# EAGLE schematic matrix (EAGLE 5.10)

## Sheet 1 of 2

## Sheet 2 of 2
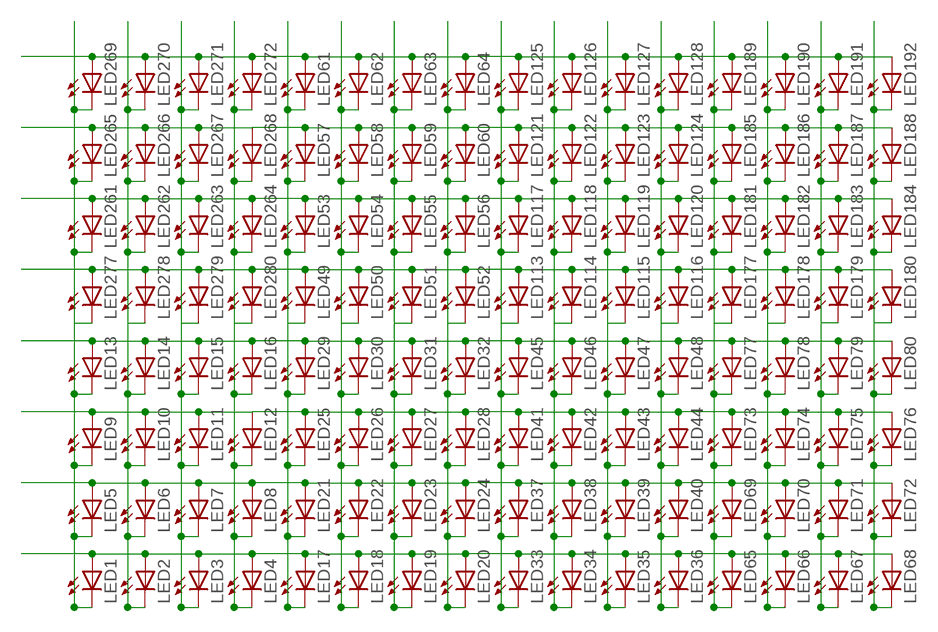
[diagram p0: schematic, sheet 2]

### Parts
LED1  LEDCHIP-LED0805  [CHIP-LED0805]
LED2  LEDCHIP-LED0805  [CHIP-LED0805]
LED3  LEDCHIP-LED0805  [CHIP-LED0805]
LED4  LEDCHIP-LED0805  [CHIP-LED0805]
LED5  LEDCHIP-LED0805  [CHIP-LED0805]
LED6  LEDCHIP-LED0805  [CHIP-LED0805]
LED7  LEDCHIP-LED0805  [CHIP-LED0805]
LED8  LEDCHIP-LED0805  [CHIP-LED0805]
LED9  LEDCHIP-LED0805  [CHIP-LED0805]
LED10  LEDCHIP-LED0805  [CHIP-LED0805]
LED11  LEDCHIP-LED0805  [CHIP-LED0805]
LED12  LEDCHIP-LED0805  [CHIP-LED0805]
LED13  LEDCHIP-LED0805  [CHIP-LED0805]
LED14  LEDCHIP-LED0805  [CHIP-LED0805]
LED15  LEDCHIP-LED0805  [CHIP-LED0805]
LED16  LEDCHIP-LED0805  [CHIP-LED0805]
LED17  LEDCHIP-LED0805  [CHIP-LED0805]
LED18  LEDCHIP-LED0805  [CHIP-LED0805]
LED19  LEDCHIP-LED0805  [CHIP-LED0805]
LED20  LEDCHIP-LED0805  [CHIP-LED0805]
LED21  LEDCHIP-LED0805  [CHIP-LED0805]
LED22  LEDCHIP-LED0805  [CHIP-LED0805]
LED23  LEDCHIP-LED0805  [CHIP-LED0805]
LED24  LEDCHIP-LED0805  [CHIP-LED0805]
LED25  LEDCHIP-LED0805  [CHIP-LED0805]
LED26  LEDCHIP-LED0805  [CHIP-LED0805]
LED27  LEDCHIP-LED0805  [CHIP-LED0805]
LED28  LEDCHIP-LED0805  [CHIP-LED0805]
LED29  LEDCHIP-LED0805  [CHIP-LED0805]
LED30  LEDCHIP-LED0805  [CHIP-LED0805]
LED31  LEDCHIP-LED0805  [CHIP-LED0805]
LED32  LEDCHIP-LED0805  [CHIP-LED0805]
LED33  LEDCHIP-LED0805  [CHIP-LED0805]
LED34  LEDCHIP-LED0805  [CHIP-LED0805]
LED35  LEDCHIP-LED0805  [CHIP-LED0805]
LED36  LEDCHIP-LED0805  [CHIP-LED0805]
LED37  LEDCHIP-LED0805  [CHIP-LED0805]
LED38  LEDCHIP-LED0805  [CHIP-LED0805]
LED39  LEDCHIP-LED0805  [CHIP-LED0805]
LED40  LEDCHIP-LED0805  [CHIP-LED0805]
LED41  LEDCHIP-LED0805  [CHIP-LED0805]
LED42  LEDCHIP-LED0805  [CHIP-LED0805]
LED43  LEDCHIP-LED0805  [CHIP-LED0805]
LED44  LEDCHIP-LED0805  [CHIP-LED0805]
LED45  LEDCHIP-LED0805  [CHIP-LED0805]
LED46  LEDCHIP-LED0805  [CHIP-LED0805]
LED47  LEDCHIP-LED0805  [CHIP-LED0805]
LED48  LEDCHIP-LED0805  [CHIP-LED0805]
LED49  LEDCHIP-LED0805  [CHIP-LED0805]
LED50  LEDCHIP-LED0805  [CHIP-LED0805]
LED51  LEDCHIP-LED0805  [CHIP-LED0805]
LED52  LEDCHIP-LED0805  [CHIP-LED0805]
LED53  LEDCHIP-LED0805  [CHIP-LED0805]
LED54  LEDCHIP-LED0805  [CHIP-LED0805]
LED55  LEDCHIP-LED0805  [CHIP-LED0805]
LED56  LEDCHIP-LED0805  [CHIP-LED0805]
LED57  LEDCHIP-LED0805  [CHIP-LED0805]
LED58  LEDCHIP-LED0805  [CHIP-LED0805]
LED59  LEDCHIP-LED0805  [CHIP-LED0805]
LED60  LEDCHIP-LED0805  [CHIP-LED0805]
LED61  LEDCHIP-LED0805  [CHIP-LED0805]
LED62  LEDCHIP-LED0805  [CHIP-LED0805]
LED63  LEDCHIP-LED0805  [CHIP-LED0805]
LED64  LEDCHIP-LED0805  [CHIP-LED0805]
LED65  LEDCHIP-LED0805  [CHIP-LED0805]
LED66  LEDCHIP-LED0805  [CHIP-LED0805]
LED67  LEDCHIP-LED0805  [CHIP-LED0805]
LED68  LEDCHIP-LED0805  [CHIP-LED0805]
LED69  LEDCHIP-LED0805  [CHIP-LED0805]
LED70  LEDCHIP-LED0805  [CHIP-LED0805]
LED71  LEDCHIP-LED0805  [CHIP-LED0805]
LED72  LEDCHIP-LED0805  [CHIP-LED0805]
LED73  LEDCHIP-LED0805  [CHIP-LED0805]
LED74  LEDCHIP-LED0805  [CHIP-LED0805]
LED75  LEDCHIP-LED0805  [CHIP-LED0805]
LED76  LEDCHIP-LED0805  [CHIP-LED0805]
LED77  LEDCHIP-LED0805  [CHIP-LED0805]
LED78  LEDCHIP-LED0805  [CHIP-LED0805]
LED79  LEDCHIP-LED0805  [CHIP-LED0805]
LED80  LEDCHIP-LED0805  [CHIP-LED0805]
LED113  LEDCHIP-LED0805  [CHIP-LED0805]
LED114  LEDCHIP-LED0805  [CHIP-LED0805]
LED115  LEDCHIP-LED0805  [CHIP-LED0805]
LED116  LEDCHIP-LED0805  [CHIP-LED0805]
LED117  LEDCHIP-LED0805  [CHIP-LED0805]
LED118  LEDCHIP-LED0805  [CHIP-LED0805]
LED119  LEDCHIP-LED0805  [CHIP-LED0805]
LED120  LEDCHIP-LED0805  [CHIP-LED0805]
LED121  LEDCHIP-LED0805  [CHIP-LED0805]
LED122  LEDCHIP-LED0805  [CHIP-LED0805]
LED123  LEDCHIP-LED0805  [CHIP-LED0805]
LED124  LEDCHIP-LED0805  [CHIP-LED0805]
LED125  LEDCHIP-LED0805  [CHIP-LED0805]
LED126  LEDCHIP-LED0805  [CHIP-LED0805]
LED127  LEDCHIP-LED0805  [CHIP-LED0805]
LED128  LEDCHIP-LED0805  [CHIP-LED0805]
LED177  LEDCHIP-LED0805  [CHIP-LED0805]
LED178  LEDCHIP-LED0805  [CHIP-LED0805]
LED179  LEDCHIP-LED0805  [CHIP-LED0805]
LED180  LEDCHIP-LED0805  [CHIP-LED0805]
LED181  LEDCHIP-LED0805  [CHIP-LED0805]
LED182  LEDCHIP-LED0805  [CHIP-LED0805]
LED183  LEDCHIP-LED0805  [CHIP-LED0805]
LED184  LEDCHIP-LED0805  [CHIP-LED0805]
LED185  LEDCHIP-LED0805  [CHIP-LED0805]
LED186  LEDCHIP-LED0805  [CHIP-LED0805]
LED187  LEDCHIP-LED0805  [CHIP-LED0805]
LED188  LEDCHIP-LED0805  [CHIP-LED0805]
LED189  LEDCHIP-LED0805  [CHIP-LED0805]
LED190  LEDCHIP-LED0805  [CHIP-LED0805]
LED191  LEDCHIP-LED0805  [CHIP-LED0805]
LED192  LEDCHIP-LED0805  [CHIP-LED0805]
LED261  LEDCHIP-LED0805  [CHIP-LED0805]
LED262  LEDCHIP-LED0805  [CHIP-LED0805]
LED263  LEDCHIP-LED0805  [CHIP-LED0805]
LED264  LEDCHIP-LED0805  [CHIP-LED0805]
LED265  LEDCHIP-LED0805  [CHIP-LED0805]
LED266  LEDCHIP-LED0805  [CHIP-LED0805]
LED267  LEDCHIP-LED0805  [CHIP-LED0805]
LED268  LEDCHIP-LED0805  [CHIP-LED0805]
LED269  LEDCHIP-LED0805  [CHIP-LED0805]
LED270  LEDCHIP-LED0805  [CHIP-LED0805]
LED271  LEDCHIP-LED0805  [CHIP-LED0805]
LED272  LEDCHIP-LED0805  [CHIP-LED0805]
LED277  LEDCHIP-LED0805  [CHIP-LED0805]
LED278  LEDCHIP-LED0805  [CHIP-LED0805]
LED279  LEDCHIP-LED0805  [CHIP-LED0805]
LED280  LEDCHIP-LED0805  [CHIP-LED0805]

### Nets
N$1: LED9.A LED10.A LED11.A LED12.A
N$2: LED1.C LED5.C LED9.C LED13.C LED277.C
N$3: LED2.C LED6.C LED10.C LED14.C LED278.C
N$4: LED3.C LED7.C LED11.C LED15.C LED279.C
N$5: LED4.C LED8.C LED12.C LED16.C LED280.C
N$6: LED17.C LED21.C LED25.C LED29.C LED49.C
N$7: LED265.A LED266.A LED267.A LED268.A
N$8: LED18.C LED22.C LED26.C LED30.C LED50.C
N$9: LED19.C LED23.C LED27.C LED31.C LED51.C
N$10: LED261.C LED265.C LED269.C
N$11: LED262.C LED266.C LED270.C
N$12: LED263.C LED267.C LED271.C
N$13: LED264.C LED268.C LED272.C
N$14: LED20.C LED24.C LED28.C LED32.C LED52.C
N$15: LED33.C LED37.C LED41.C LED45.C LED113.C
N$16: LED34.C LED38.C LED42.C LED46.C LED114.C
N$17: LED35.C LED39.C LED43.C LED47.C LED115.C
N$18: LED36.C LED40.C LED44.C LED48.C LED116.C
N$19: LED13.A LED14.A LED15.A LED16.A LED29.A LED30.A LED31.A LED32.A LED45.A LED46.A LED47.A LED48.A LED77.A LED78.A LED79.A LED80.A
N$20: LED25.A LED26.A LED27.A LED28.A LED41.A LED42.A LED43.A LED44.A LED73.A LED74.A LED75.A LED76.A
N$21: LED5.A LED6.A LED7.A LED8.A LED21.A LED22.A LED23.A LED24.A LED37.A LED38.A LED39.A LED40.A LED69.A LED70.A LED71.A LED72.A
N$22: LED1.A LED2.A LED3.A LED4.A LED17.A LED18.A LED19.A LED20.A LED33.A LED34.A LED35.A LED36.A LED65.A LED66.A LED67.A LED68.A
N$23: LED65.C LED69.C LED73.C LED77.C LED177.C
N$24: LED66.C LED70.C LED74.C LED78.C LED178.C
N$25: LED67.C LED71.C LED75.C LED79.C LED179.C
N$26: LED68.C LED72.C LED76.C LED80.C LED180.C
N$37: LED53.C LED57.C LED61.C
N$38: LED54.C LED58.C LED62.C
N$39: LED55.C LED59.C LED63.C
N$40: LED56.C LED60.C LED64.C
N$69: LED117.C LED121.C LED125.C
N$70: LED118.C LED122.C LED126.C
N$71: LED119.C LED123.C LED127.C
N$72: LED120.C LED124.C LED128.C
N$97: LED61.A LED62.A LED63.A LED64.A LED125.A LED126.A LED127.A LED128.A LED189.A LED190.A LED191.A LED192.A LED269.A LED270.A LED271.A LED272.A
N$98: LED57.A LED58.A LED59.A LED60.A LED121.A LED122.A LED123.A LED124.A LED185.A LED186.A LED187.A LED188.A
N$99: LED53.A LED54.A LED55.A LED56.A LED117.A LED118.A LED119.A LED120.A LED181.A LED182.A LED183.A LED184.A LED261.A LED262.A LED263.A LED264.A
N$100: LED49.A LED50.A LED51.A LED52.A LED113.A LED114.A LED115.A LED116.A LED177.A LED178.A LED179.A LED180.A LED277.A LED278.A LED279.A LED280.A
N$101: LED181.C LED185.C LED189.C
N$102: LED182.C LED186.C LED190.C
N$103: LED183.C LED187.C LED191.C
N$104: LED184.C LED188.C LED192.C

## Library data of the parts
LED1-LED80 LED113-LED128 LED177-LED192 LED261-LED272 LED277-LED280 = led:LED: LED OSRAM: - CHIPLED LG R971, LG N971, LY N971, LG Q971, LY Q971, LO R971, LY R971 LH N974, LH R974 LS Q976, LO Q976, LY Q976 LO Q996 - Hyper CHIPLED LW Q18S LB Q993, LB Q99A, LB R99A - SideLED LS A670, LO A670, LY A670, LG A670, LP A670 LB A673, LV A673, LT A673, LW A673 LH A674 LY A675 LS A676, LA A676, LO A676, LY A676, LW A676 LS A679, LY A679, LG A679 - Hyper Micro SIDELED® LS Y876, LA Y876, LO Y876, LY Y876 LT Y87S - SmartLED LW L88C, LW L88S LB L89C, LB L89S, LG L890 LS L89K, LO L89K, LY L89K LS L896, LA L896, LO L896, LY L896 - TOPLED LS T670, LO T670, LY T670, LG T670, LP T670 LSG T670, LSP T670, LSY T670, LOP T670, LYG T670 LG T671, LOG T671, LSG T671 LB T673, LV T673, LT T673, LW T673 LH T674 LS T676, LA T676, LO T676, LY T676, LB T676, LH T676, LSB T676, LW T676 LB T67C, LV T67C, LT T67C, LS T67K, LO T67K, LY T67K, LW E67C LS E67B, LA E67B, LO E67B, LY E67B, LB E67C, LV E67C, LT E67C LW T67C LS T679, LY T679, LG T679 LS T770, LO T770, LY T770, LG T770, LP T770 LB T773, LV T773, LT T773, LW T773 LH T774 LS E675, LA E675, LY E675, LS T675 LS T776, LA T776, LO T776, LY T776, LB T776 LHGB T686 LT T68C, LB T68C - Hyper Mini TOPLED® LB M676 - Mini TOPLED Santana® LG M470 LS M47K, LO M47K, LY M47K Source: http://www.osram.convergy.de LUXEON: - LUMILED® LXK2-PW12-R00, LXK2-PW12-S00, LXK2-PW14-U00, LXK2-PW14-V00 LXK2-PM12-R00, LXK2-PM12-S00, LXK2-PM14-U00 LXK2-PE12-Q00, LXK2-PE12-R00, LXK2-PE12-S00, LXK2-PE14-T00, LXK2-PE14-U00 LXK2-PB12-K00, LXK2-PB12-L00, LXK2-PB12-M00, LXK2-PB14-N00, LXK2-PB14-P00, LXK2-PB14-Q00 LXK2-PR12-L00, LXK2-PR12-M00, LXK2-PR14-Q00, LXK2-PR14-R00 LXK2-PD12-Q00, LXK2-PD12-R00, LXK2-PD12-S00 LXK2-PH12-R00, LXK2-PH12-S00 LXK2-PL12-P00, LXK2-PL12-Q00, LXK2-PL12-R00 Source: www.luxeon.com KINGBRIGHT: KA-3528ASYC Source: www.kingbright.com